# Altium schematic sheet top.SchDoc: Weller RT soldering station
size A4; DrawnBy: Grzegorz Gajoch; Address1: Grzegorz Gajoch; Address2: grzegorz@gajoch.pl; Revision: 1
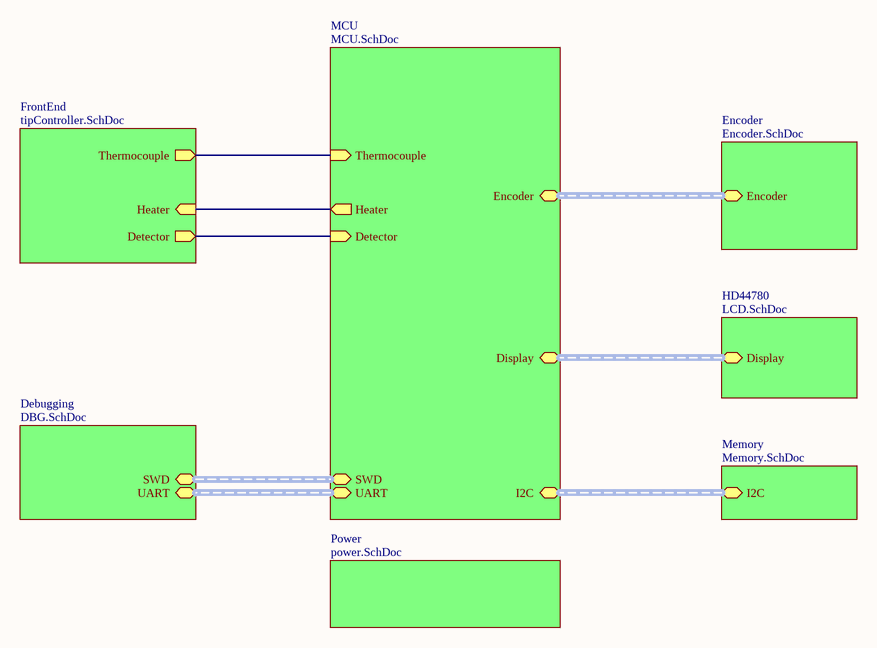
[diagram p0: top.SchDoc]

## Sub-sheets
Debugging = DBG.SchDoc: SWD (harness SWD), UART (harness UART)
Encoder = Encoder.SchDoc: Encoder (harness Encoder)
FrontEnd = tipController.SchDoc: Thermocouple (out), Heater (in), Detector (out)
HD44780 = LCD.SchDoc: Display (harness Display)
MCU = MCU.SchDoc: Display (harness Display), Thermocouple (in), Encoder (harness Encoder), Heater (out), SWD (harness SWD), UART (harness UART), Detector (in), I2C (harness I2C)
Memory = Memory.SchDoc: I2C (harness I2C)
Power = power.SchDoc: no entries

## Nets
(unnamed): sheet MCU/Thermocouple, sheet FrontEnd/Thermocouple
(unnamed): sheet MCU/Heater, sheet FrontEnd/Heater
(unnamed): sheet MCU/Detector, sheet FrontEnd/Detector

## Buses and harness runs
harness sheet Debugging/SWD = sheet MCU/SWD
harness sheet Debugging/UART = sheet MCU/UART
harness sheet Encoder/Encoder = sheet MCU/Encoder
harness sheet HD44780/Display = sheet MCU/Display
harness sheet MCU/I2C = sheet Memory/I2C

## Notes on the sheet
- Title
- Size:
- Date:
- A4
- Number:
- Time:
- Revision:
- Sheet
- of
- File: